# EAGLE design SonicScrewdriverThru (EAGLE 6.5.0)
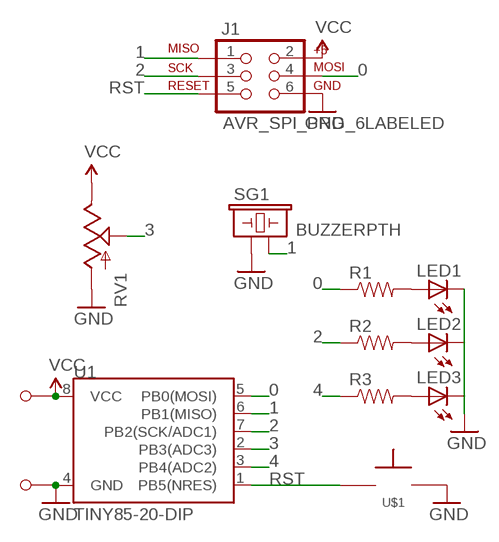
[diagram p0: schematic, sheet 1]

## Parts
J1  AVR_SPI_PRG_6LABELED  [2X3-NS]
LED1  LEDOVAL  [LED-OVAL]
LED2  LEDOVAL  [LED-OVAL]
LED3  LEDOVAL  [LED-OVAL]
R1  RESISTORAXIAL-0.3  [AXIAL-0.3]
R2  RESISTORAXIAL-0.3  [AXIAL-0.3]
R3  RESISTORAXIAL-0.3  [AXIAL-0.3]
RV1  POTTHUMB  [THUMB]
SG1  BUZZERPTH  [BUZZER-12MM]
U1  TINY85-20-DIP  ATTINY45TINY85-20-DIP  [DIP08]
U$1  TAC_SPST_NO  [TAC_SPST_NO]
U$2  M1  [M1_NO_STRAIN]
U$3  M1  [M1_NO_STRAIN]

## Nets
0: J1.4 R1.P$1 U1.5(PB0(MOSI))
1: J1.1 SG1.- U1.6(PB1(MISO))
2: J1.3 R2.P$1 U1.7(PB2(SCK/ADC1))
3: RV1.B(S) U1.2(PB3(ADC3))
4: R3.P$1 U1.3(PB4(ADC2))
GND: J1.6 LED1.CATHODE(C) LED2.CATHODE(C) LED3.CATHODE(C) RV1.A SG1.+ U1.4(GND) U$1.P$2 U$3.P$1
N$1: LED1.ANODE(A) R1.P$2
N$2: LED2.ANODE(A) R2.P$2
N$3: LED3.ANODE(A) R3.P$2
RST: J1.5 U1.1(PB5(NRES)) U$1.P$1
VCC: J1.2 RV1.C(E) U1.8(VCC) U$2.P$1

## Library data of the parts
J1 = barbary_enterprises:AVR_SPI_PRG_6: AVR ISP 6 Pin This is the reduced ISP connector for AVR programming. Common on Arduino. This footprint will take up less PCB space and can be used with a 10-pin to 6-pin adapter such as SKU: BOB-08508
LED1-LED3 = barbary_enterprises:LED: LEDs Standard schematic elements and footprints for 5mm, 3mm, 1206, and 0603 sized LEDs. 5mm - Spark Fun Electronics SKU : COM-00529 (and others)
R1-R3 = barbary_enterprises:RESISTOR: Resistor Basic schematic elements and footprints for 0603, 1206, and PTH resistors.
RV1 = barbary_enterprises:POT
SG1 = SparkFun-Electromechanical:BUZZER: Buzzer 12mm Spark Fun Electronics SKU : Comp-Buzzer
U1 = SparkFun-DigitalIC:ATTINY45: Atmel 8-pin 2/4/8kB flash uC; PROD_ID: IC-09445
U$1 = barbary_enterprises:TAC_SPST_NO: 3,5 mm Tact Switches C&K PTS635 Series * Digi-Key Part Number: CKN9102-ND
U$2 U$3 = barbary_enterprises:M1

## Board
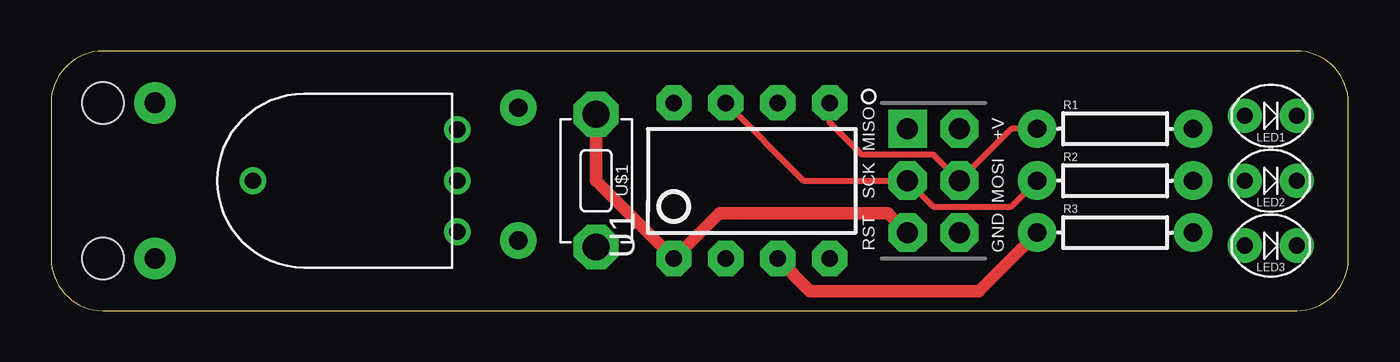
[diagram p1: board, top side]
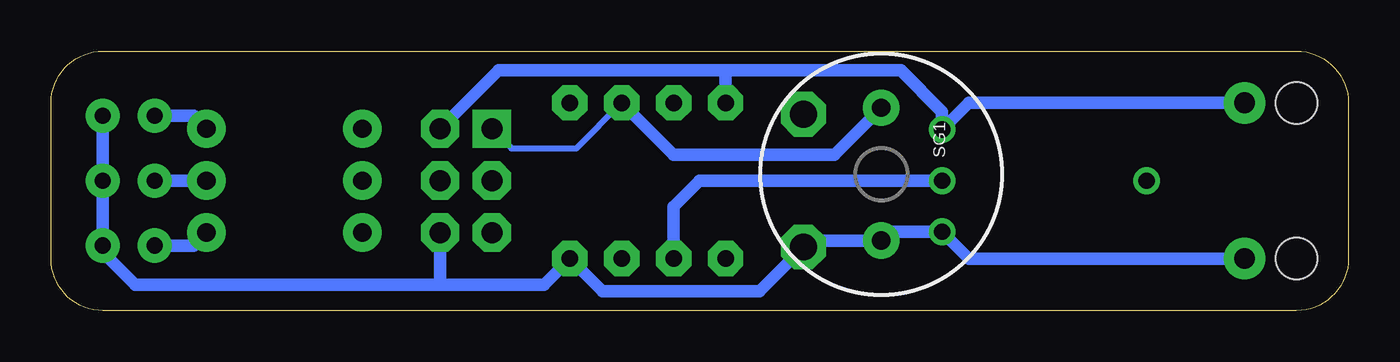
[diagram p2: board, bottom side, seen from below]

Size 63.49 x 12.69 mm. Coordinates in mm from the lower left corner, seen from the top.
Outline: 2.54,0 60.96,0 arc90 63.49,2.53 63.49,10.16 arc90 60.96,12.69 2.54,12.69 arc90 0,10.15 0,2.54 arc90 2.54,0
Copper layers (1*16): Top 0.035mm / dielectric 1.5mm / Bottom 0.035mm
Design rules "default": minimum track width 10mil, minimum drill 24mil, track to track 8mil, track to pad 8mil, pad to pad 8mil, via to via 8mil, smd to smd 8mil, copper to edge 40mil, drill to drill 8mil, minimum pad ring 10mil, minimum via ring 8mil, stop-mask expansion 4mil, vias tented up to drill 0mil, thermal gap 10mil

### Footprints (pad centres in the part's own frame; a part is rotated, then mirrored left to right if it is on the bottom)
2X3-NS = drill 1.016 pad 1.88 square: 1 -2.54,-1.27 | drill 1.016 pad 1.88 octagon: 2 -2.54,1.27; 3 0,-1.27; 4 0,1.27; 5 2.54,-1.27; 6 2.54,1.27
LED-OVAL = drill 0.8 pad 1.676: ANODE 1.27,0; CATHODE -1.27,0
AXIAL-0.3 = drill 0.9 pad 1.88: P$1 -3.81,0; P$2 3.81,0
THUMB = drill 0.8: A -2.5,-7.5; B 0,-7.5; B` 0,2.5; C 2.5,-7.5
BUZZER-12MM = drill 0.9 pad 1.778: + 3.25,0; - -3.25,0
DIP08 = drill 0.813 pad 1.727 octagon: 1 -3.81,-3.81; 2 -1.27,-3.81; 3 1.27,-3.81; 4 3.81,-3.81; 5 3.81,3.81; 6 1.27,3.81; 7 -1.27,3.81; 8 -3.81,3.81
TAC_SPST_NO = drill 1.3 pad 2.184 octagon: P$1 -3.251,0; P$2 3.251,0
M1_NO_STRAIN = drill 1.016 pad 2.032: P$1 0,0 | hole 2.032: 2.54,0

### Placement (x,y rotation side)
J1  43.18,6.35 270 top
LED1  59.69,9.53 180 top
LED2  59.69,6.35 180 top
LED3  59.69,3.17 180 top
R1  52.07,8.89 0 top
R2  52.07,6.35 0 top
R3  52.07,3.81 0 top
RV1  12.38,6.35 90 top
SG1  22.86,6.67 270 bottom
U1  34.29,6.35 0 top
U$1  26.67,6.35 270 top
U$2  5.08,10.16 180 top
U$3  5.08,2.54 180 top

### Tracks (layer width: path | path; a pad name or v marks a point on that pad's centre or on a via)
0
  Top 0.305: R1.P$1 46.99,8.89 J1.4 43.18,7.62 39.69,7.62 38.1,9.21 U1.5
1
  Bottom 0.305: J1.1 40.96,7.94 37.78,7.94 U1.6
  Bottom 0.61: SG1.- 25.16,7.62 33.02,7.62 U1.6
2
  Top 0.305: U1.7 36.83,6.35 J1.3 43.18,5.08 46.99,5.08 R2.P$1
3
  Bottom 0.61: RV1.B 31.75,6.35 33.02,5.08 U1.2
4
  Top 0.61: U1.3 37.15,0.95 45.4,0.95 R3.P$1
GND
  Bottom 0.61: LED1.CATHODE LED2.CATHODE LED3.CATHODE 60.96,2.86 59.37,1.27 44.45,1.27 | 44.45,1.27 39.37,1.27 U1.4 36.51,0.95 28.82,0.95 U$1.P$2 26.35,3.42 SG1.+ 22.43,3.85 RV1.A 18.57,2.54 U$3.P$1 | J1.6 44.45,1.27
N$1
  Bottom 0.61: LED1.ANODE 56.52,9.53 R1.P$2
N$2
  Bottom 0.61: LED2.ANODE R2.P$2
N$3
  Bottom 0.61: LED3.ANODE 56.52,3.17 R3.P$2
RST
  Top 0.61: U$1.P$1 26.67,6.35 U1.1 32.7,4.76 40.96,4.76 J1.5
VCC
  Bottom 0.61: U$2.P$1 18.57,10.16 RV1.C 19.88,9.72 21.91,11.75 30.48,11.75 | 30.48,11.75 U1.8 | J1.2 41.59,11.75 30.48,11.75